# EAGLE design Ivy Sensor Shield (EAGLE 7.2.0)
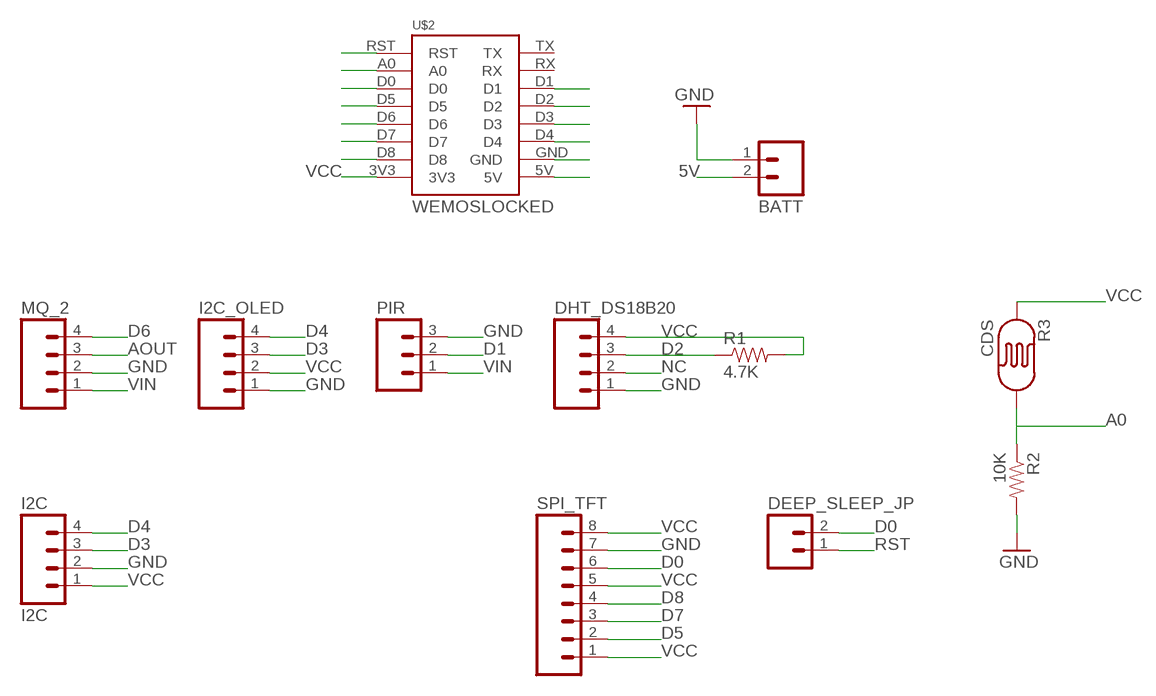
[diagram p0: schematic, sheet 1]

## Parts
BATT  M02PTH  [1X02]
DEEP_SLEEP_JP  M02PTH  [1X02]
DHT_DS18B20  M04PTH  [1X04]
I2C  I2C  M04PTH  [1X04]
I2C_OLED  M04PTH  [1X04]
MQ_2  M04PTH  [1X04]
PIR  M03PTH  [1X03]
R1  4.7K  RESISTOR0805-RES  [0805]
R2  10K  RESISTOR0805-RES  [0805]
R3  CDS  PHOTOCELL  [PHOTOCELL_THIN]
SPI_TFT  M08  [1X08_ROUND]
U$2  WEMOSLOCKED  [WEMOS_LOCKED]

## Nets
5V: BATT.2 U$2.5V
A0: R2.1 R3.2 U$2.A0
AOUT: MQ_2.3
D0: DEEP_SLEEP_JP.2 SPI_TFT.6 U$2.D0
D1: PIR.2 U$2.D1
D2: DHT_DS18B20.3 R1.1 U$2.D2
D3: I2C.3 I2C_OLED.3 U$2.D3
D4: I2C.4 I2C_OLED.4 U$2.D4
D5: SPI_TFT.2 U$2.D5
D6: MQ_2.4 U$2.D6
D7: SPI_TFT.3 U$2.D7
D8: SPI_TFT.4 U$2.D8
GND: BATT.1 DHT_DS18B20.1 I2C.2 I2C_OLED.1 MQ_2.2 PIR.3 R2.2 SPI_TFT.7 U$2.GND
NC: DHT_DS18B20.2
RST: DEEP_SLEEP_JP.1 U$2.RST
VCC: DHT_DS18B20.4 I2C.1 I2C_OLED.2 R1.2 R3.1 SPI_TFT.1 SPI_TFT.5 SPI_TFT.8 U$2.3V3
VIN: MQ_2.1 PIR.1
Unconnected: U$2.RX U$2.TX

## Library data of the parts
BATT DEEP_SLEEP_JP = SparkFun-Connectors:M02: Standard 2-pin 0.1" header. Use with - straight break away headers ( PRT-00116) - right angle break away headers (PRT-00553) - swiss pins (PRT-00743) - machine pins (PRT-00117) - female headers (PRT-00115) Molex polarized connector foot print use with: PRT-08233 with associated crimp pins and housings. 2.54_SCREWTERM for use with PRT-10571. 3.5mm Screw Terminal footprints for PRT-08084 5mm Screw Terminal footprints for use with PRT-08432
DHT_DS18B20 I2C I2C_OLED MQ_2 = SparkFun-Connectors:M04: Header 4 Standard 4-pin 0.1" header. Use with straight break away headers (SKU : PRT-00116), right angle break away headers (PRT-00553), swiss pins (PRT-00743), machine pins (PRT-00117), and female headers (PRT-00115). Molex polarized connector foot print use with SKU : PRT-08231 with associated crimp pins and housings. 1MM SMD Version SKU: PRT-10208
PIR = SparkFun-Connectors:M03: Header 3 Standard 3-pin 0.1" header. Use with straight break away headers (SKU : PRT-00116), right angle break away headers (PRT-00553), swiss pins (PRT-00743), machine pins (PRT-00117), and female headers (PRT-00115). Molex polarized connector foot print use with SKU : PRT-08232 with associated crimp pins and housings.
R1 R2 = SparkFun-Passives:RESISTOR: Resistor Basic schematic elements and footprints for 0603, 1206, and PTH resistors.
R3 = SparkFun-Sensors:PHOTOCELL: CdS photoresistor. This is a low cost way to detect light levels. Resistance decreases with more incoming light. SparkFun SKU: SEN-09088
SPI_TFT = SparkFun-Connectors:M08: Header 8 Standard 8-pin 0.1" header. Use with straight break away headers (SKU : PRT-00116), right angle break away headers (PRT-00553), swiss pins (PRT-00743), machine pins (PRT-00117), and female headers (PRT-00115).
U$2 = My Eagle Lib:WEMOS

## Board
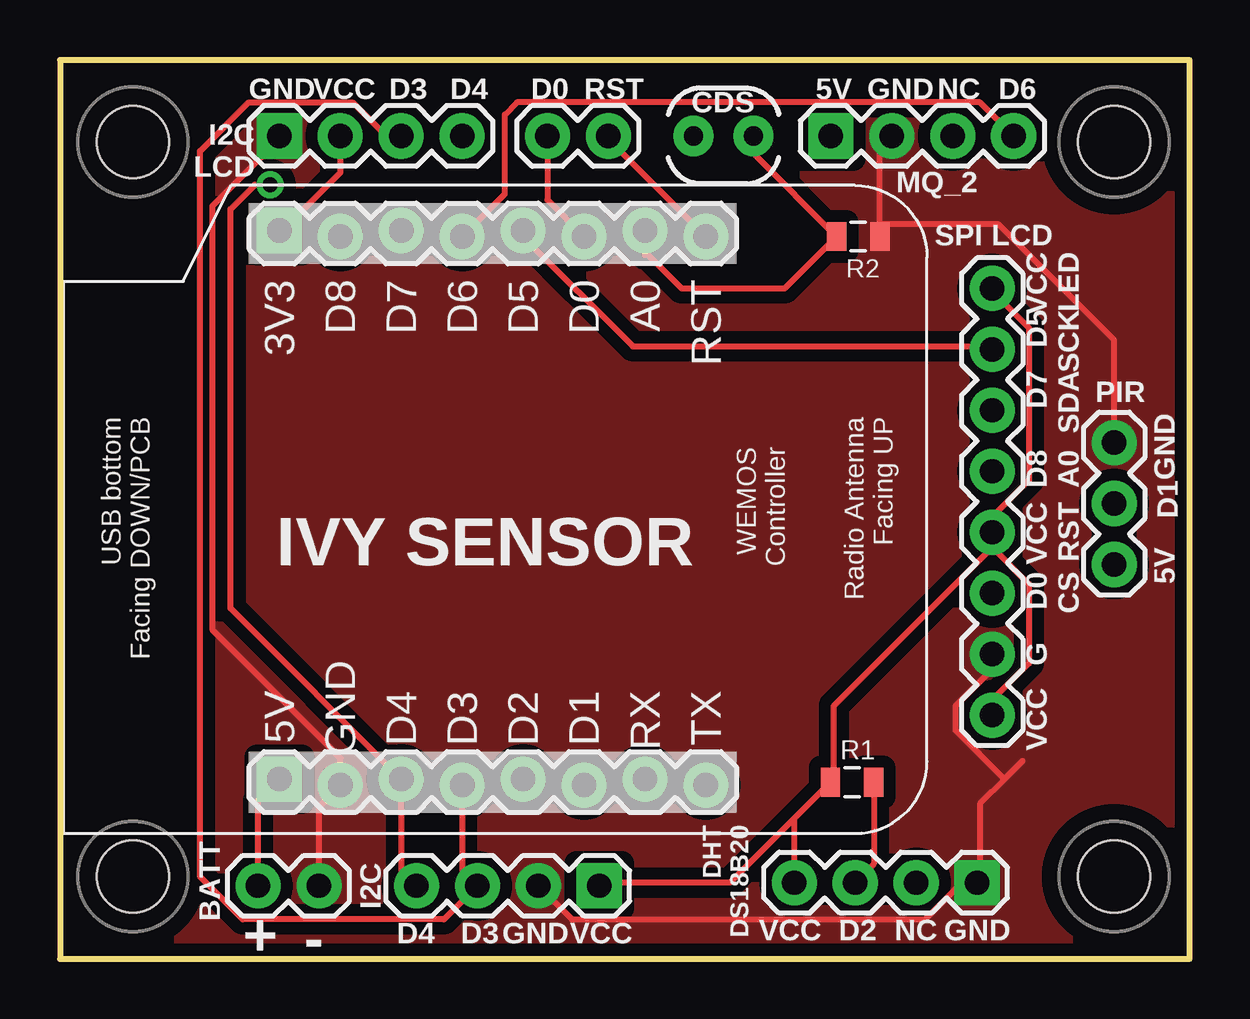
[diagram p1: board, top side]
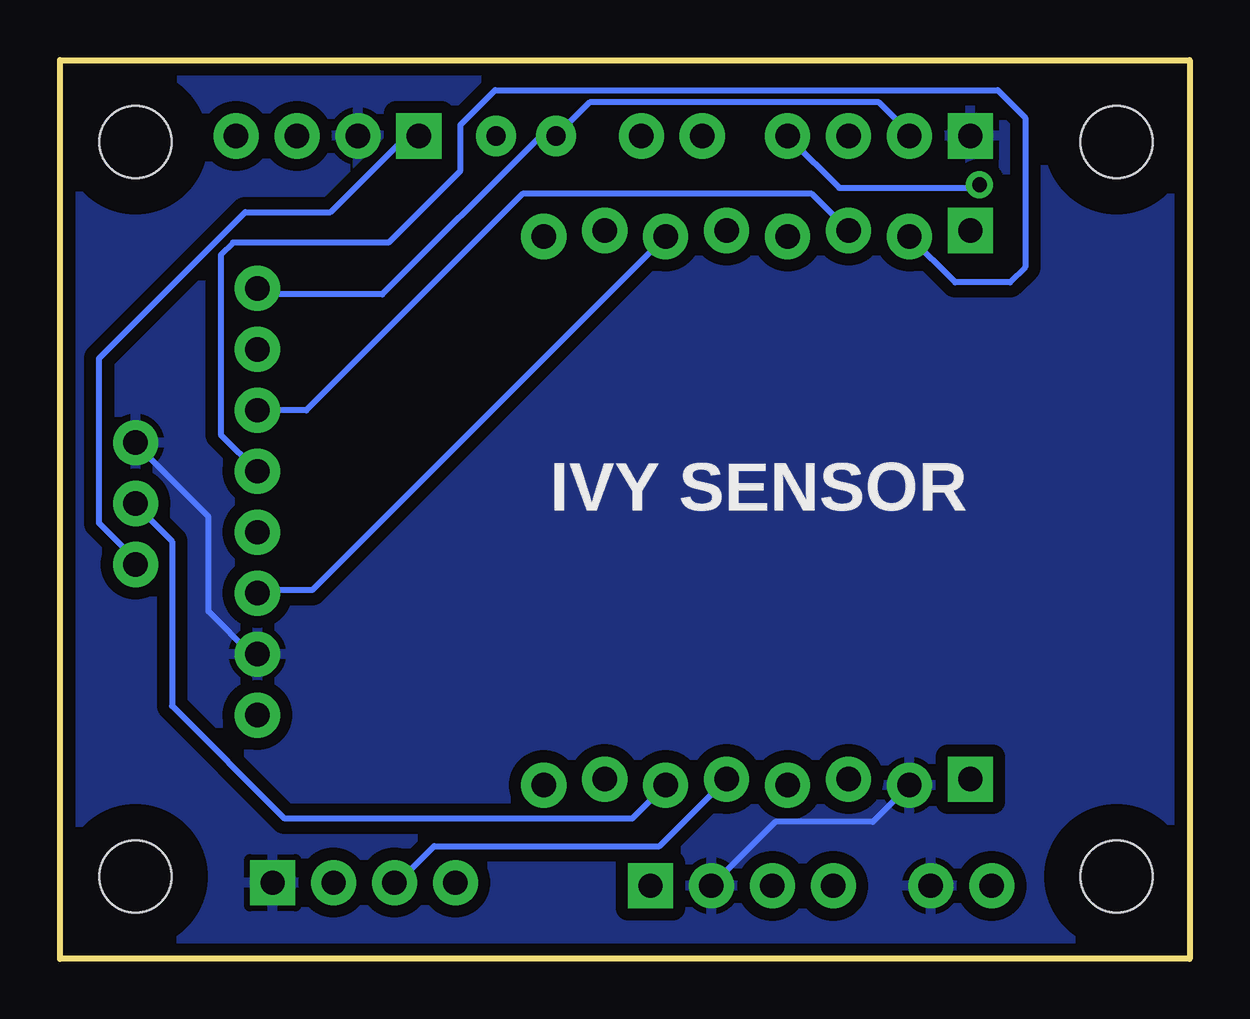
[diagram p2: board, bottom side, seen from below]

Size 47.09 x 37.45 mm. Coordinates in mm from the lower left corner, seen from the top.
Outline: 0,0 47.09,0 47.09,37.45 0,37.45 0,0
Copper layers (1*16): Top 0.035mm / dielectric 1.5mm / Bottom 0.035mm
Design rules "default *": minimum track width 10mil, minimum drill 24mil, track to track 10mil, track to pad 10mil, pad to pad 10mil, via to via 10mil, smd to smd 8mil, copper to edge 20mil, drill to drill 12mil, minimum pad ring 13mil, minimum via ring 10mil, stop-mask expansion 4mil, vias tented up to drill 0mil, thermal gap 10mil

### Footprints (pad centres in the part's own frame; a part is rotated, then mirrored left to right if it is on the bottom)
1X02 = drill 1.016 pad 1.88: 1 0,0; 2 2.54,0
1X04 = drill 1.016 pad 1.88 square: 1 0,0 | drill 1.016 pad 1.88: 2 2.54,0; 3 5.08,0; 4 7.62,0
1X03 = drill 1.016 pad 1.88: 1 0,0; 2 2.54,0; 3 5.08,0
0805 = smd 0.8 x 1.2: 1 -0.9,0; 2 0.9,0
PHOTOCELL_THIN = drill 0.8 pad 1.676: 1 -1.15,0; 2 1.35,0
1X08_ROUND = drill 1.016 pad 1.88: 1 0,0; 2 2.54,0; 3 5.08,0; 4 7.62,0; 5 10.16,0; 6 12.7,0; 7 15.24,0; 8 17.78,0
WEMOS_LOCKED = drill 1.016 pad 1.88 square: 3V3 -0.127,0; 5V 22.733,0 | drill 1.016 pad 1.88: A0 -0.127,15.24; D0 0.127,12.7; D1 22.987,12.7; D2 22.733,10.16; D3 22.987,7.62; D4 22.733,5.08; D5 -0.127,10.16; D6 0.127,7.62; D7 -0.127,5.08; D8 0.127,2.54; GND 22.987,2.54; RST 0.127,17.78; RX 22.733,15.24; TX 22.987,17.78
KFH-M3 = hole 3: 0,0

### Placement (x,y rotation side)
BATT  10.8,3.05 180 top
DEEP_SLEEP_JP  22.86,34.29 180 top
DHT_DS18B20  38.23,3.17 180 top
I2C  22.48,3.05 180 top
I2C_OLED  9.14,34.29 0 top
MQ_2  32.13,34.29 0 top
PIR  43.94,16.43 90 top
R1  33.02,7.37 180 top
R2  33.27,30.1 0 top
R3  27.56,34.29 0 top
SPI_TFT  38.86,27.94 270 top
U$2  9.14,30.23 270 top
U$6  [KFH-M3]  3.05,3.43 0 top
U$7  [KFH-M3]  43.94,3.43 0 top
U$8  [KFH-M3]  43.94,34.04 0 top
U$9  [KFH-M3]  3.05,34.04 0 top

### Tracks (layer width: path | path; a pad name or v marks a point on that pad's centre or on a via)
5V
  Top 0.254: BATT.2 8.26,6.6 U$2.5V
A0
  Top 0.254: R3.2 28.91,33.56 R2.1 30.22,27.94 25.91,27.94 24.45,29.4 | 24.38,29.46 24.45,29.4 | U$2.A0 24.38,29.34 24.45,29.4
D0
  Top 0.254: DEEP_SLEEP_JP.2 20.32,31.62 U$2.D0
  Bottom 0.254: U$2.D0 36.58,15.37 38.86,15.37 SPI_TFT.6
D1
  Bottom 0.254: PIR.2 43.94,18.92 42.42,17.4 42.42,10.54 37.72,5.84 23.24,5.84 U$2.D1
D2
  Top 0.254: R1.1 33.92,3.95 DHT_DS18B20.3
  Bottom 0.254: DHT_DS18B20.3 33.02,3.17 31.5,4.7 22.1,4.7 U$2.D2
D3
  Top 0.254: I2C_OLED.3 14.22,34.42 13.46,34.42 12.19,35.69 7.87,35.69 5.84,33.65 5.84,3.43 7.62,1.65 16,1.65 I2C.3 16.76,3.68 U$2.D3
D4  (via drill 0.61)
  Top 0.254: 8.51,32.26 v8.76,32.26 8.13,32.26 7.11,31.24 7.11,14.6 U$2.D4 14.22,3.68 I2C.4
  Bottom 0.254: I2C_OLED.4 16.76,34.16 16.64,34.16 14.61,32.13 8.89,32.13 v8.76,32.26
D5
  Top 0.254: SPI_TFT.2 38.86,25.53 23.88,25.53 19.3,30.1 U$2.D5
D6
  Top 0.254: MQ_2.4 38.35,35.69 19.05,35.69 18.54,35.18 18.54,31.88 U$2.D6
D7
  Bottom 0.254: U$2.D7 15.75,31.88 27.81,31.88 36.83,22.86 SPI_TFT.3 38.86,22.99
D8
  Bottom 0.254: SPI_TFT.4 40.39,21.84 40.39,29.34 39.88,29.84 33.4,29.84 30.4,32.84 30.4,34.75 28.96,36.2 8,36.2 6.86,35.05 6.86,28.83 7.49,28.19 9.78,28.19 U$2.D8
GND
  Top 0.254: BATT.1 10.8,6.35 U$2.GND 11.68,8.38 6.35,13.72 6.35,31.37 9.14,34.16 I2C_OLED.1 | MQ_2.2 34.17,33.79 R2.2 34.29,30.61 39.12,30.61 43.94,25.78 PIR.3 | 40.13,8.25 39.37,7.49 | 39.37,7.49 38.35,6.48 38.35,3.17 DHT_DS18B20.1 37.59,3.17 36.07,1.65 21.34,1.65 I2C.2 | SPI_TFT.7 38.86,12.06 37.34,10.54 37.34,9.52 39.37,7.49
  Bottom 0.254: U$2.GND 13.21,5.71 17.27,5.71 I2C.2 | PIR.3 43.94,21.46 40.89,18.41 40.89,14.48 39.12,12.7 SPI_TFT.7
  pour Bottom (isolate 0.508): -6.48,40.64 57.91,41.02 57.91,-6.6 -6.48,-6.99
  pour Top (isolate 0.508, no thermals): -6.48,40.64 57.91,41.02 57.91,-6.6 -6.48,-6.99
RST
  Top 0.254: DEEP_SLEEP_JP.1 22.86,34.16 U$2.RST
VCC
  Top 0.254: DHT_DS18B20.4 30.61,5.85 | 30.61,5.85 R1.2 32.26,7.49 32.26,10.54 38.86,17.14 | I2C_OLED.2 11.68,32.77 9.27,30.35 U$2.3V3 | 30.61,5.85 27.93,3.17 22.61,3.17 I2C.1 | SPI_TFT.8 38.86,10.79 40.39,12.32 40.39,15.62 38.86,17.14 | 38.86,17.14 SPI_TFT.5 38.86,18.41 40.39,19.94 40.39,26.29 38.86,27.81 SPI_TFT.1
  Bottom 0.254: I2C_OLED.2 11.68,34.42 12.95,35.69 25.01,35.69 R3.1 26.42,34.16 27.18,34.16 33.66,27.69 38.61,27.69 SPI_TFT.1 38.86,27.81 | 38.86,17.91 SPI_TFT.5
VIN
  Bottom 0.254: MQ_2.1 32.26,34.16 32.77,34.16 35.81,31.12 39.37,31.12 45.47,25.02 45.47,18.16 43.94,16.64 PIR.1

### Text on the board
tNames: GND | VCC | D3 | D4 | D0 | RST | 5V | GND | NC | D6 | I2C / LCD | SPI LCD | VCC / LED | D5 / SCK | D7 / SDA | GND | D8 / A0 | D1 | VCC / RST | 5V | IVY SENSOR | D0 / CS | G | VCC | DHT / DS18B20 | D4 | D3 | GND | VCC | VCC | D2 | NC | GND | + | -
bNames: IVY SENSOR